# Altium schematic sheet 25 AUDIO_CONN.SchDoc
size 420 x 297 mm
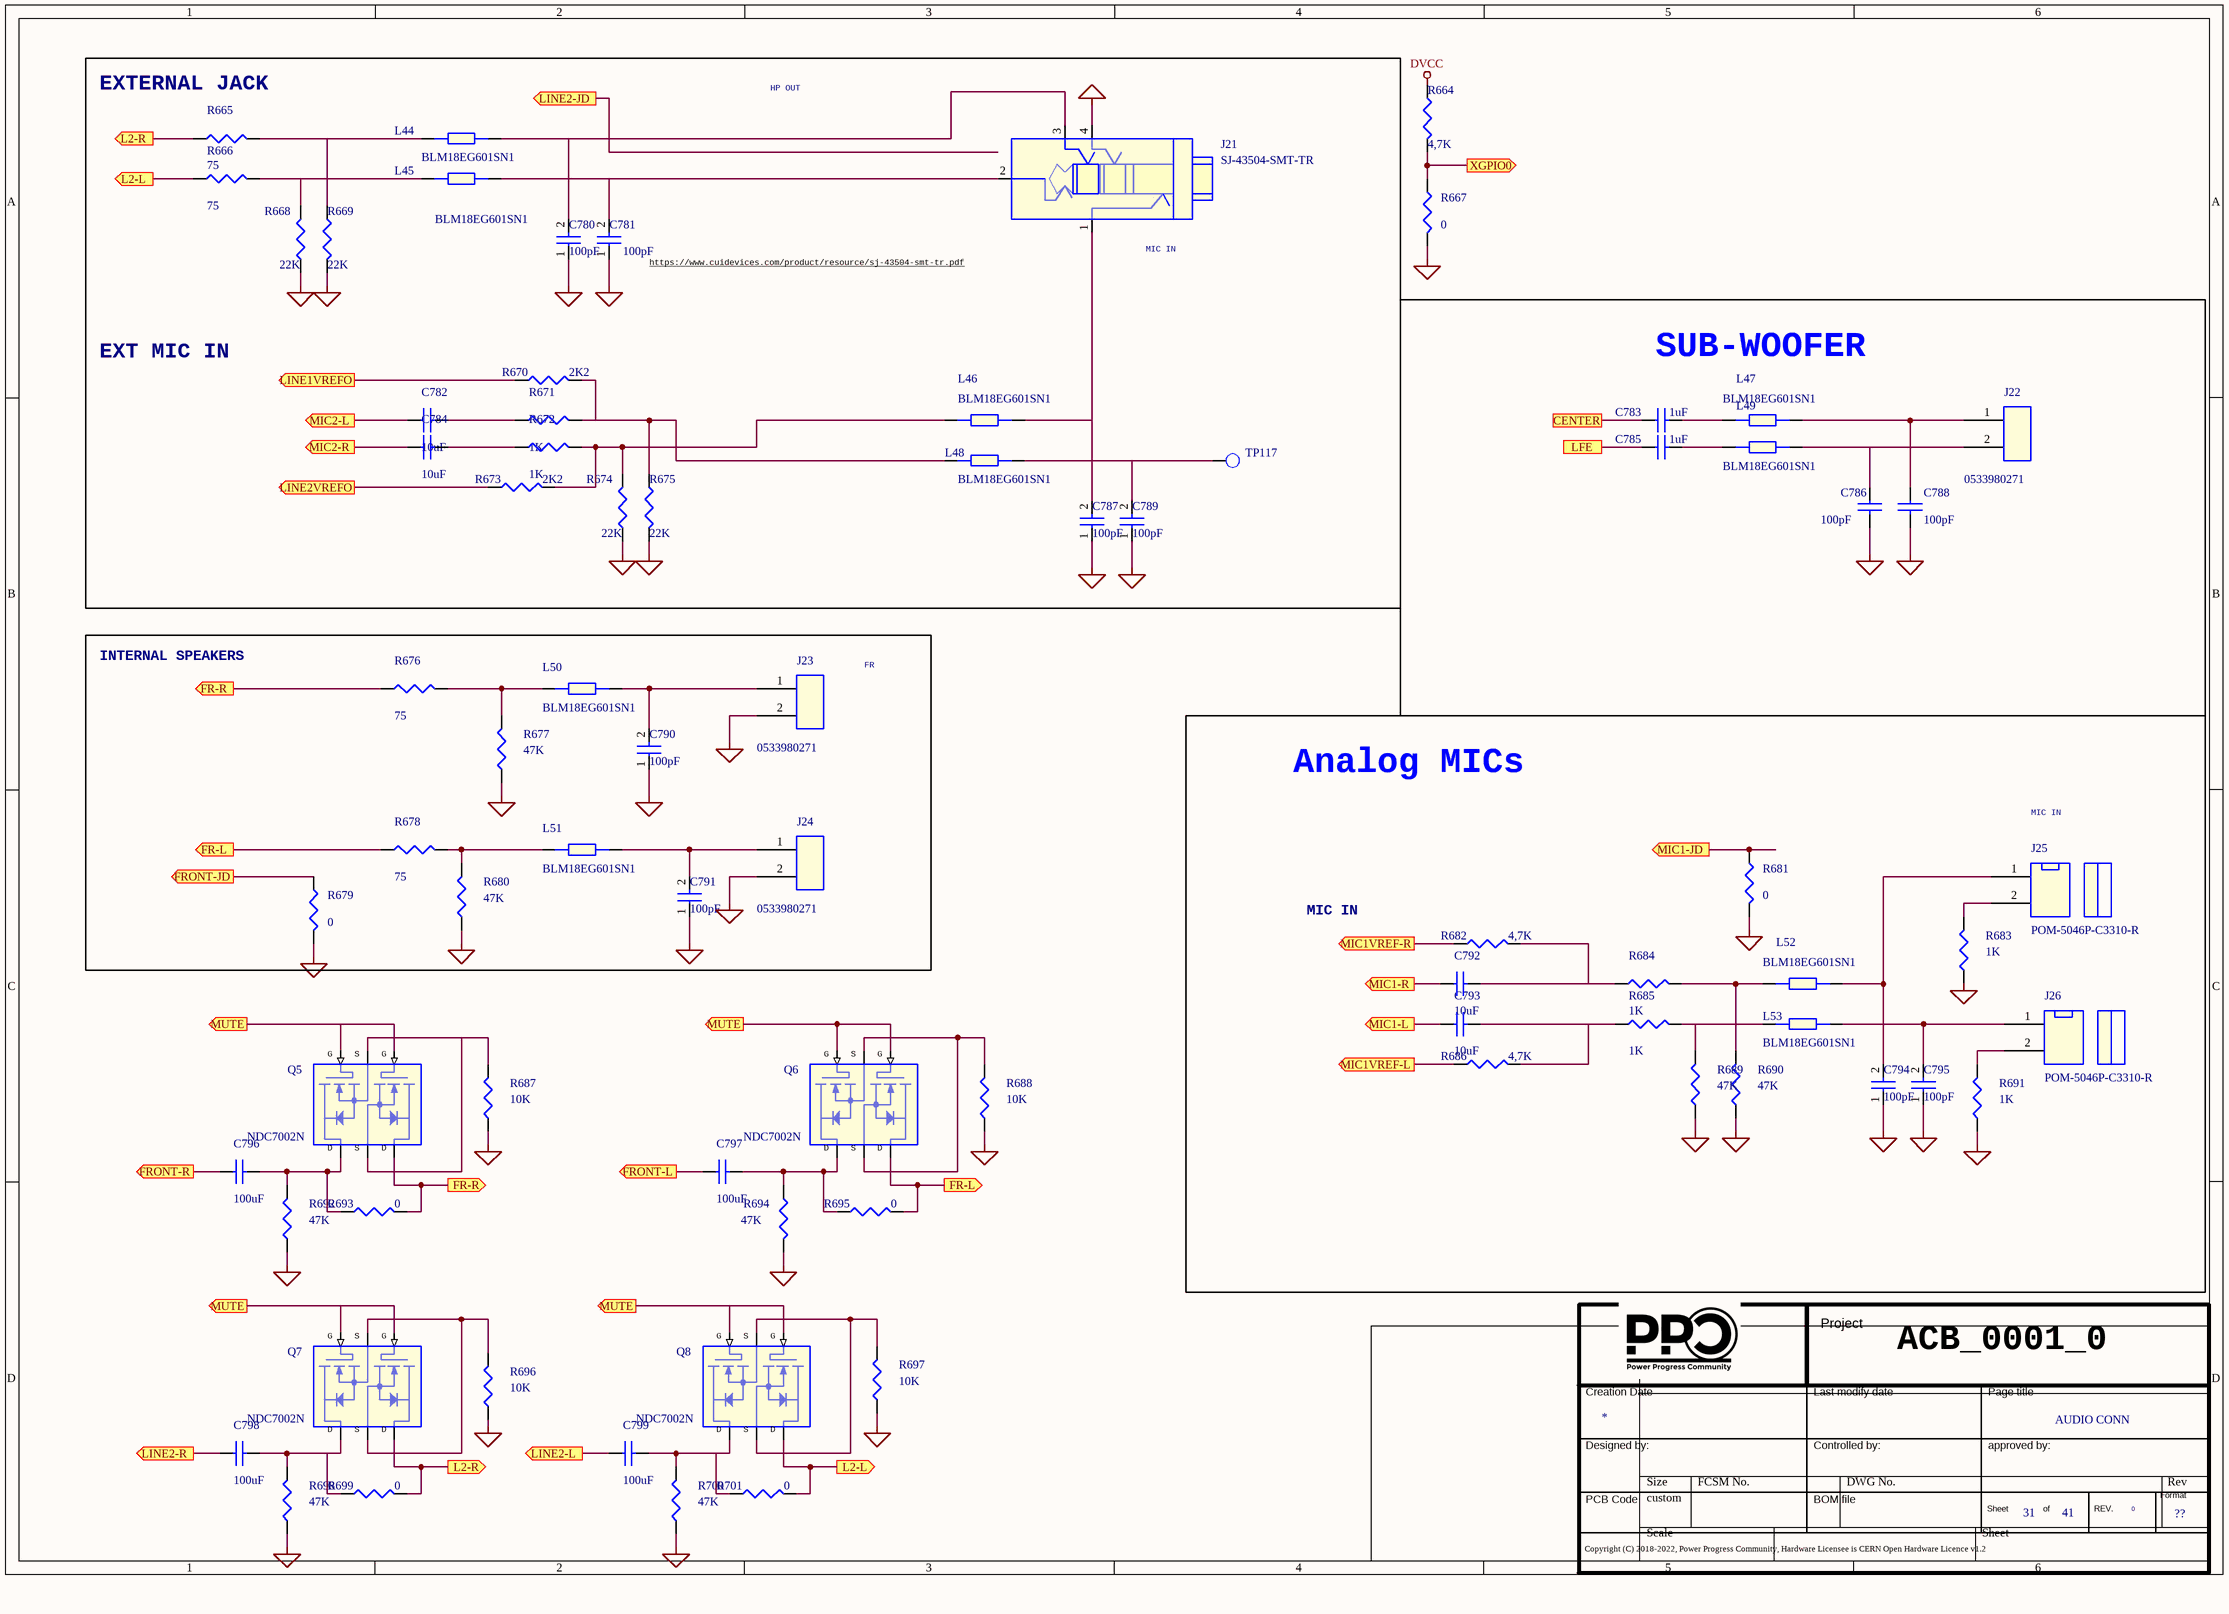
[diagram p0: 25 AUDIO_CONN.SchDoc]

## Parts
*  Doc: AUDIO CONN  Page Count: 41  Page Number: 31  Page Size: ??  RevCode: 0  (hidden comment: Title_block_PPC)  (graphical)
C780  100pF  [SMD_0402]
C781  100pF  [SMD_0402]
C782  10uF  [SMD_0603]
C783  1uF  [SMD_0402]
C784  10uF  [SMD_0603]
C785  1uF  [SMD_0402]
C786  100pF  [SMD_0402]
C787  100pF  [SMD_0402]
C788  100pF  [SMD_0402]
C789  100pF  [SMD_0402]
C790  100pF  [SMD_0402]
C791  100pF  [SMD_0402]
C792  10uF  [SMD_0603]
C793  10uF  [SMD_0603]
C794  100pF  [SMD_0402]
C795  100pF  [SMD_0402]
C796  100uF  [SMD_1210]
C797  100uF  [SMD_1210]
C798  100uF  [SMD_1210]
C799  100uF  [SMD_1210]
J21  SJ-43504-SMT-TR  [SMT]
J22  0533980271  [2P SMD]
J23  0533980271  [2P SMD]
J24  0533980271  [2P SMD]
J25  POM-5046P-C3310-R  [SMD_2X50_P=0.635mm]
J26  POM-5046P-C3310-R  [SMD_2X50_P=0.635mm]
L44  BLM18EG601SN1  [SMD_0603]
L45  BLM18EG601SN1  [SMD_0603]
L46  BLM18EG601SN1  [SMD_0603]
L47  BLM18EG601SN1  [SMD_0603]
L48  BLM18EG601SN1  [SMD_0603]
L49  BLM18EG601SN1  [SMD_0603]
L50  BLM18EG601SN1  [SMD_0603]
L51  BLM18EG601SN1  [SMD_0603]
L52  BLM18EG601SN1  [SMD_0603]
L53  BLM18EG601SN1  [SMD_0603]
Q5  NDC7002N  [SSOT_6]
Q6  NDC7002N  [SSOT_6]
Q7  NDC7002N  [SSOT_6]
Q8  NDC7002N  [SSOT_6]
R664  4,7K  [SMD_0402]
R665  75  [SMD_0402]
R666  75  [SMD_0402]
R667  0  [SMD_0402]
R668  22K  [SMD_0402]
R669  22K  [SMD_0402]
R670  2K2  [SMD_0402]
R671  1K  [SMD_0402]
R672  1K  [SMD_0402]
R673  2K2  [SMD_0402]
R674  22K  [SMD_0402]
R675  22K  [SMD_0402]
R676  75  [SMD_0402]
R677  47K  [SMD_0402]
R678  75  [SMD_0402]
R679  0  [SMD_0402]
R680  47K  [SMD_0402]
R681  0  [SMD_0402]
R682  4,7K  [SMD_0402]
R683  1K  [SMD_0402]
R684  1K  [SMD_0402]
R685  1K  [SMD_0402]
R686  4,7K  [SMD_0402]
R687  10K  [SMD_0402]
R688  10K  [SMD_0402]
R689  47K  [SMD_0402]
R690  47K  [SMD_0402]
R691  1K  [SMD_0402]
R692  47K  [SMD_0402]
R693  0  [SMD_0402]
R694  47K  [SMD_0402]
R695  0  [SMD_0402]
R696  10K  [SMD_0402]
R697  10K  [SMD_0402]
R698  47K  [SMD_0402]
R699  0  [SMD_0402]
R700  47K  [SMD_0402]
R701  0  [SMD_0402]
TP117  TEST POINT  [PCB]  (value not drawn)

## Blocks framed on the sheet
SUB-WOOFER: C783 C785 C786 C788 J22 L47 L49
INTERNAL SPEAKERS: C790 C791 J23 J24 L50 L51 R676-R680
Analog MICs: C792-C795 J25 J26 L52 L53 R681-R686 R689-R691

## Ports
CENTER, FR-L (out), FR-R (out), FRONT-JD (out), FRONT-L (out), FRONT-R (out), L2-L (out), L2-R (out), LFE, LINE1VREFO (out), LINE2-JD (out), LINE2-L (out), LINE2-R (out), LINE2VREFO (out), MIC1-JD (out), MIC1-L (out), MIC1-R (out), MIC1VREF-L (out), MIC1VREF-R (out), MIC2-L (out), MIC2-R (out), MUTE (out), XGPIO0 (out)

## Nets
AGND: C780.1 C781.1 C786.2 C787.1 C788.2 C789.1 C790.1 C791.1 C794.1 C795.1 J21.4(GND) J23.2 J24.2 R667.2 R668.2 R669.2 R674.2 R675.2 R677.1 R679.2 R680.1 R681.2 R683.2 R687.1 R688.1 R689.1 R690.1 R691.2 R692.1 R694.1 R696.1 R697.1 R698.1 R700.1
DVCC: R664.1
CENTER: C783.1 ; port CENTER
FR-L: Q6.6(D1) R678.2 R695.2 ; port FR-L
FR-R: Q5.6(D1) R676.2 R693.2 ; port FR-R
FRONT-JD: R679.1 ; port FRONT-JD
FRONT-L: C797.1 ; port FRONT-L
FRONT-R: C796.1 ; port FRONT-R
L2-L: Q8.6(D1) R666.2 R701.2 ; port L2-L
L2-R: Q7.6(D1) R665.2 R699.2 ; port L2-R
LFE: C785.1 ; port LFE
LINE1VREFO: R670.2 ; port LINE1VREFO
LINE2-L: C799.1 ; port LINE2-L
LINE2-R: C798.1 ; port LINE2-R
LINE2VREFO: R673.2 ; port LINE2VREFO
MIC1-JD: R681.1 ; port MIC1-JD
MIC1-L: C793.1 ; port MIC1-L
MIC1-R: C792.1 ; port MIC1-R
MIC1VREF-L: R686.2 ; port MIC1VREF-L
MIC1VREF-R: R682.2 ; port MIC1VREF-R
MIC2-L: C782.1 ; port MIC2-L
MIC2-R: C784.1 ; port MIC2-R
MUTE: Q5.1(G1) Q5.3(G2) Q6.1(G1) Q6.3(G2) Q7.1(G1) Q7.3(G2) Q8.1(G1) Q8.3(G2) ; port MUTE
XGPIO0: R664.2 R667.1 ; port XGPIO0
NetC780_2: C780.2 J21.3(R) L44.1
NetC781_2: C781.2 J21.2(L) L45.1
NetC782_2: C782.2 R671.2
NetC783_2: C783.2 L47.2
NetC784_2: C784.2 R672.2
NetC785_2: C785.2 L49.2
NetC786_1: C786.1 J22.2 L49.1
NetC787_2: C787.2 J21.1(MIC) L46.1
NetC788_1: C788.1 J22.1 L47.1
NetC789_2: C789.2 L48.1 TP117.1(TP)
NetC790_2: C790.2 J23.1 L50.1
NetC791_2: C791.2 J24.1 L51.1
NetC792_2: C792.2 R682.1 R684.2
NetC793_2: C793.2 R685.2 R686.1
NetC794_2: C794.2 J25.1 L52.1
NetC795_2: C795.2 J26.1 L53.1
NetC796_2: C796.2 Q5.4(D2) R692.2 R693.1
NetC797_2: C797.2 Q6.4(D2) R694.2 R695.1
NetC798_2: C798.2 Q7.4(D2) R698.2 R699.1
NetC799_2: C799.2 Q8.4(D2) R700.2 R701.1
NetJ25_2: J25.2 R683.1
NetJ26_2: J26.2 R691.1
NetL44_2: L44.2 R665.1 R669.1
NetL45_2: L45.2 R666.1 R668.1
NetL46_2: L46.2 R672.1 R673.1 R674.1
NetL48_2: L48.2 R670.1 R671.1 R675.1
NetL50_2: L50.2 R676.1 R677.2
NetL51_2: L51.2 R678.1 R680.2
NetL52_2: L52.2 R684.1 R690.2
NetL53_2: L53.2 R685.1 R689.2
NetQ5_2: Q5.2(S2) Q5.5(S1) R687.2
NetQ6_2: Q6.2(S2) Q6.5(S1) R688.2
NetQ7_2: Q7.2(S2) Q7.5(S1) R696.2
NetQ8_2: Q8.2(S2) Q8.5(S1) R697.2

## Notes on the sheet
- (near R665) EXTERNAL JACK
- HP OUT
- MIC IN
- (near C781) https://www.cuidevices.com/product/resource/sj-43504-smt-tr.pdf
- EXT MIC IN
- FR
- (near Q5) G
- (near Q5) S
- (near Q6) G
- (near Q6) S
- (near Q5) D
- (near Q6) D
- (near Q7) G
- (near Q7) S
- (near Q8) G
- (near Q8) S
- ACB_0001_0
- (near Q7) D
- (near Q8) D
- (in symbol Title_block_PPC) Project; Creation Date; Last modify date; Page title; Designed by:; Controlled by:; approved by:; Format; PCB Code; BOM file; Sheet; of; REV.; Copyright (C) 2018-2022, Power Progress Community, Hardware Licensee is CERN Open Hardware Licence v1.2

## Library data of the parts
* = Title_block_PPC: Title: T2080PCIe; Author: MICETEK; Page Create Date: March  8, 1995; Page Title: ?; Page Modify Date: *
C780 C781 C787 C789-C791 C794 C795 = CAP NP_Dup1: COND.CER. 100PF 50V 0402 NPO 5% SMD; Manufacturer Part Number 1: GRM1555C1H101JD01D; Manufacturer 1: Murata; Part Number: PASSIVE_26; RSM: RC0402; PCB Footprint: SMD_0402; Part Type: Capacitors\Ceramic\SMD\0402
C782 C784 C792 C793 = CAP NP_Dup3: COND.CER.10uF 0603 25V SMD; Part Number: PASSIVE_124; Manufacturer 1: SAMSUNG; Manufacturer Part Number 1: CL10A106MA8NRNC; RSM: RC0603; Part Type: Capacitors\Ceramic\SMD\0603; PCB Footprint: SMD_0603
C783 C785 = CAP NP_Dup3: CAP CER 1.0UF 6.3V 10% X5R 0402; Part Number: PASSIVE_51; Manufacturer 1: Murata; Manufacturer Part Number 1: GRM155R60J105KE19D; RSM: RC0402; PCB Footprint: SMD_0402; Part Type: Capacitors\Ceramic\SMD\0402
C786 C788 = CAP NP_Dup3: 0402 100pF 50volts C0G 5%; Manufacturer Part Number 1: GRM1555C1H101JZ01D; Manufacturer 1: Murata; Part Number: PASSIVE_27; RSM: RC0402; Part Type: Capacitors\Ceramic\SMD\0402; PCB Footprint: SMD_0402
C796-C799 = CAP NP_Dup3: CAP CER 100UF 16V 20% X5R 1210; Part Number: PASSIVE_264; Manufacturer 1: Taiyo Yuden; Manufacturer Part Number 1: EMK325ABJ107MM-T; RSM: RC1210; Part Type: Capacitors\Ceramic\SMD\1210; PCB Footprint: SMD_1210
J21 = SJ-435107_0: 3.5 PHONEJACK TRRS MID Mount; Manufacturer 1: CUI Inc; Part Number: CONNECTORS_705; RSM: CUI-SJ-43504-SMT-TR; RoHS: YES; PCB Footprint: SMT; Distributor 1: DIGIKEY(CP-43504SJCT-ND - Cut ); Manufacturer Part Number 1: SJ-43504-SMT-TR; Part Type: JACK
J22 J23 = HEADER_2: HDR 2 CKT VERTICAL  1.25MM; Part Number: CONNECTORS_273; Manufacturer 1: MOLEX; TECNO77: CN-MLX-53261-2P; RSM: MOLEX-53398-2; Part Type: PICOBLADE; Manufacturer Part Number 1: 0533980271; Distributor 1: DIGIKEY(WM7606CT-ND); PCB Footprint: 2P SMD
J24 = HEADER_2: HDR 2 CKT VERTICAL  1.25MM; Part Number: CONNECTORS_273; Manufacturer 1: MOLEX; RSM: MOLEX-53398-2; TECNO77: CN-MLX-53261-2P; PCB Footprint: 2P SMD; Part Type: PICOBLADE; Manufacturer Part Number 1: 0533980271; Distributor 1: DIGIKEY(WM7606CT-ND)
J25 J26 = Microfono: MIC COND ANALOG OMNI -46DB 6MM D; PART NUMBER: MISC_270; Manufacturer 1: PUI AUDIO; PCB Footprint: 6X5_2 (mm); TECNO77: MICRO_POM-5246P-R; RSM: POM-5046P-C3310-R; Part Type: microphone; Manufacturer Part Number 1: POM-5046P-C3310-R; Distributor 1: DIGIKEY(668-1677-ND)
L44 L48 L50 L51 L53 = FERRITE_BEAD: FERRITE BEAD 600ohm 500mA 0603 SMD; Manufacturer Part Number 1: BLM18EG601SN1 SMD; Manufacturer 1: Murata; Part Number: PASSIVE_377; RSM: RC0603; Part Type: Ferrite Beads\SMD\0603; PCB Footprint: SMD_0603
L45-L47 L49 L52 = FERRITE_BEAD: FERRITE BEAD 600ohm 500mA 0603 SMD; Part Number: PASSIVE_377; Manufacturer 1: Murata; Manufacturer Part Number 1: BLM18EG601SN1 SMD; RSM: RC0603; Part Type: Ferrite Beads\SMD\0603; PCB Footprint: SMD_0603
Q5 Q6 Q8 = MTD4P05_2: MOSFET 2N-CH 50V 0.51A SSOT6; Manufacturer 1: ON Semi; Part Number: DISCRETE_322; RSM: SSOT-6; PCB Footprint: SSOT_6; Distributor 1: DIGIKEY (NDC7002NCT-ND); Manufacturer Part Number 1: NDC7002N; Part Type: Mosfet\SOT23
Q7 = MTD4P05_2: MOSFET 2N-CH 50V 0.51A SSOT6; Part Number: DISCRETE_322; Manufacturer 1: ON Semi; RSM: SSOT-6; PCB Footprint: SSOT_6; Part Type: Mosfet\SOT23; Manufacturer Part Number 1: NDC7002N; Distributor 1: DIGIKEY (NDC7002NCT-ND)
R664 R682 R686 = R_Dup3: RES 4.7K OHM 1/10W 1% 0402 SMD; Manufacturer Part Number 1: ERJ-2RKF4701X; Manufacturer 1: PANASONIC; Part Number: PASSIVE_718; RSM: RC0402; PCB Footprint: SMD_0402; Part Type: Resistors\Fixed\SMD\0402\1%
R665 R666 R676 R678 = R_Dup6: RESIS.CHIP 75R 1% 0402 SMD; Manufacturer Part Number 1: RMC1/16SK75R0FTH; Manufacturer 1: KAMAYA; Part Number: PASSIVE_783; RSM: RC0402; PCB Footprint: SMD_0402; Part Type: Resistors\Fixed\SMD\0402\1%
R667 R679 R681 = R_Dup6: RESIS.CHIP 0R 5% 0402 SMD; Part Number: PASSIVE_805; Manufacturer 1: ROYAL OHM; RSM: RC0402; PCB Footprint: SMD_0402; Part Type: Resistors\Fixed\SMD\0402\5%; Manufacturer Part Number 1: RESIS.CHIP 0R 5% 0402 SMD; Distributor 1: CAMEL ELETTRONICA SRL  #
R668 R669 R674 R675 = R_Dup3: RESIS.CHIP 22K 5% 0402 SMD; Part Number: PASSIVE_843; Manufacturer 1: ROYAL OHM; RSM: RC0402; Part Type: Resistors\Fixed\SMD\0402\5%; PCB Footprint: SMD_0402; Manufacturer Part Number 1: RESIS.CHIP 22K 5% 0402 SMD
R670 R673 = R_Dup3: RESIS.CHIP2K2 1% 0402 SMD; Part Number: PASSIVE_1456; Manufacturer 1: YAGEO; Manufacturer Part Number 1: RT0402DRD072K2L; RSM: RC0402; Part Type: Resistors\Fixed\SMD\0402\1%; PCB Footprint: SMD_0402
R671 R672 R683-R685 R691 = R_Dup6: RESIS.CHIP 1K 1% 0402 SMD; Part Number: PASSIVE_628; Manufacturer 1: ROYAL OHM; RSM: RC0402; Part Type: Resistors\Fixed\SMD\0402\1%; PCB Footprint: SMD_0402; Manufacturer Part Number 1: RESIS.CHIP 1K 1% 0402 SMD
R677 R680 R689 R690 R692 R694 R698 R700 = R_Dup6: RESIS.CHIP 47K 1% 0402 SMD; Manufacturer 1: ROYAL OHM; Part Number: PASSIVE_737; RSM: RC0402; Manufacturer Part Number 1: RESIS.CHIP 47K 1% 0402 SMD; PCB Footprint: SMD_0402; Part Type: Resistors\Fixed\SMD\0402\1%
R687 R688 R696 R697 = R_Dup6: RESIS.CHIP 10K 1% 0402 SMD; Part Number: PASSIVE_584; Manufacturer 1: ROYAL OHM; RSM: RC0402; Part Type: Resistors\Fixed\SMD\0402\1%; PCB Footprint: SMD_0402; Manufacturer Part Number 1: RESIS.CHIP 10K 1% 0402 SMD
R693 R695 R699 R701 = R_Dup1: RESIS.CHIP 0R 5% 0402 SMD; Part Number: PASSIVE_805; Manufacturer 1: ROYAL OHM; RSM: RC0402; Part Type: Resistors\Fixed\SMD\0402\5%; PCB Footprint: SMD_0402; Manufacturer Part Number 1: RESIS.CHIP 0R 5% 0402 SMD
TP117 = T POINT R: TEST POINT SU PCB; Part Number: CONNECTORS_542; RSM: AE-TESTPOINT; PCB Footprint: PCB; Part Type: Tpoint